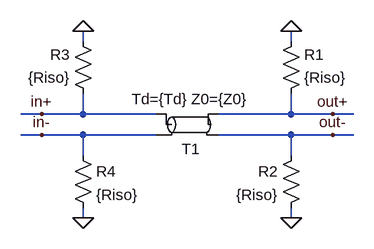
[diagram p0: schematic tlineRiso.asc]
tlineRiso.asc, the LTspice schematic file:
Version 4
SHEET 1 880 692
WIRE 0 256 0 240
WIRE 320 256 320 240
WIRE -64 368 -96 368
WIRE 0 368 0 336
WIRE 0 368 -64 368
WIRE 112 368 0 368
WIRE 320 368 320 336
WIRE 320 368 208 368
WIRE 384 368 320 368
WIRE 416 368 384 368
WIRE -64 400 -96 400
WIRE 0 400 -64 400
WIRE 112 400 0 400
WIRE 320 400 208 400
WIRE 384 400 320 400
WIRE 416 400 384 400
WIRE 0 432 0 400
WIRE 320 432 320 400
WIRE 0 528 0 512
WIRE 320 528 320 512
FLAG -64 368 in+
FLAG 0 240 0
FLAG -64 400 in-
FLAG 0 528 0
FLAG 384 368 out+
FLAG 320 240 0
FLAG 384 400 out-
FLAG 320 528 0
SYMBOL tline 160 384 R0
WINDOW 0 6 22 Top 2
WINDOW 3 6 -24 Bottom 2
SYMATTR InstName T1
SYMATTR Value Td={Td} Z0={Z0}
SYMBOL res 16 352 R180
WINDOW 0 36 76 Left 2
WINDOW 3 36 40 Left 2
SYMATTR InstName R3
SYMATTR Value {Riso}
SYMBOL res -16 416 R0
SYMATTR InstName R4
SYMATTR Value {Riso}
SYMBOL res 304 352 M180
WINDOW 0 36 76 Left 2
WINDOW 3 36 40 Left 2
SYMATTR InstName R1
SYMATTR Value {Riso}
SYMBOL res 336 416 M0
SYMATTR InstName R2
SYMATTR Value {Riso}

The netlist it stands for:
* tlineRiso.asc
T1 in+ in- out+ out- Td={Td} Z0={Z0}
R3 in+ 0 {Riso}
R4 in- 0 {Riso}
R1 out+ 0 {Riso}
R2 out- 0 {Riso}
.backanno
.end